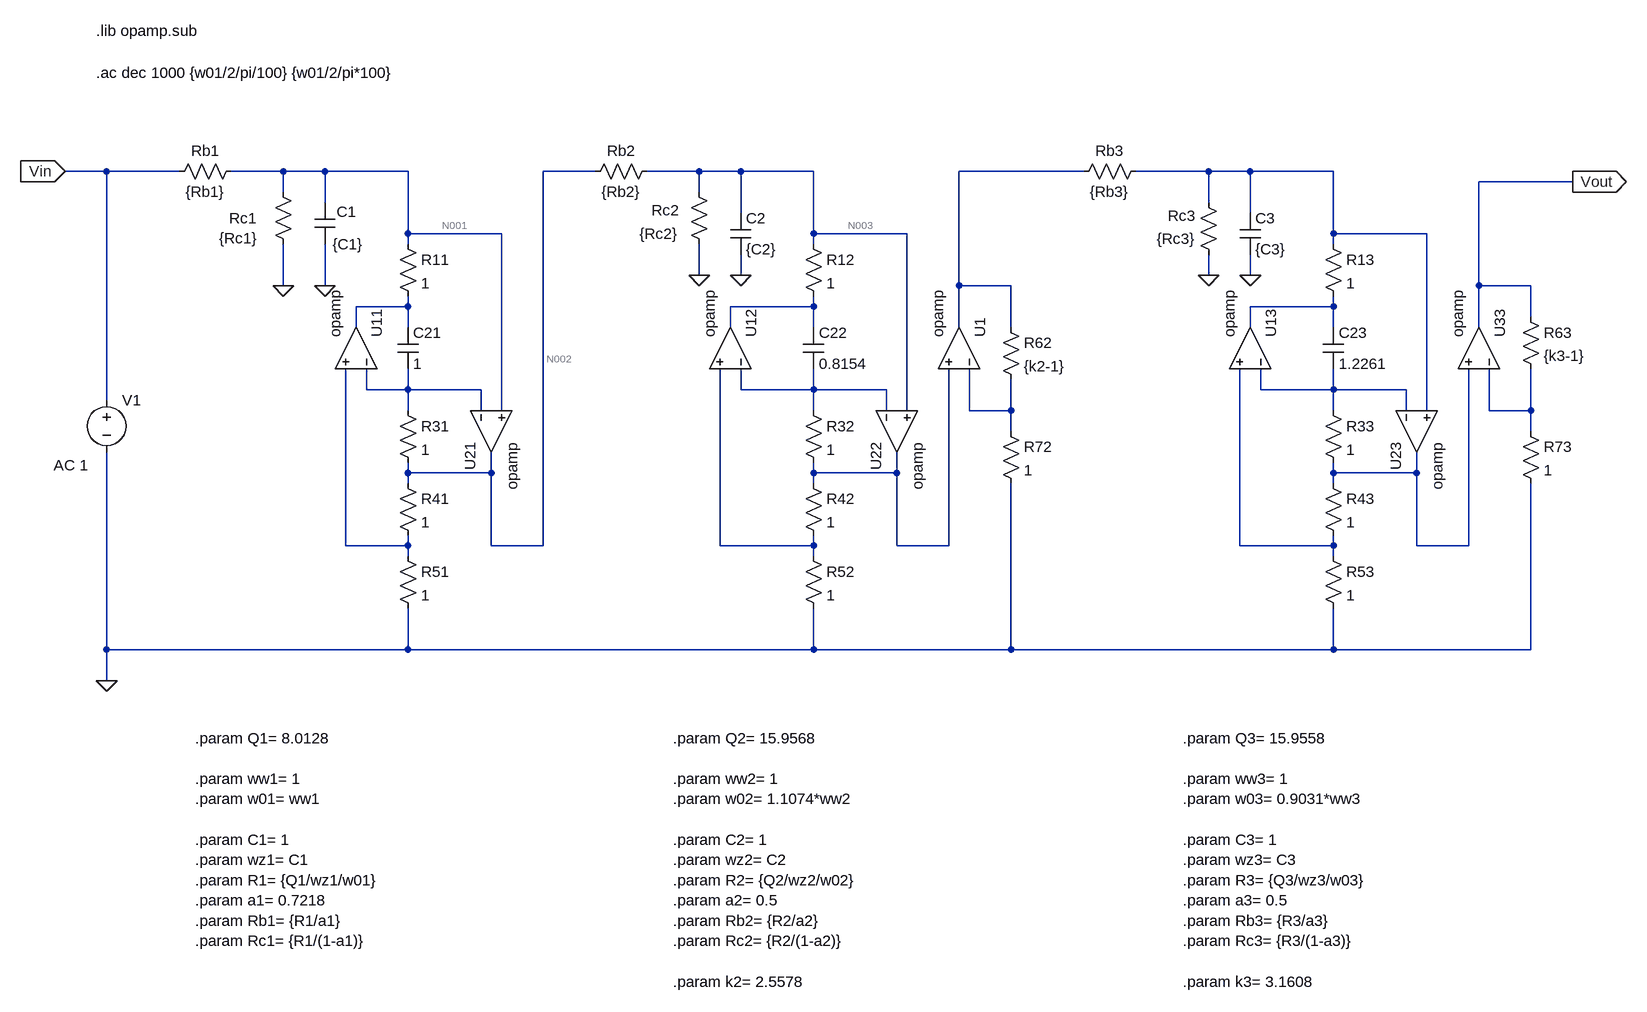
[diagram p0: schematic TS5_LTSpice_Red_Pasiva_SOSs_Acopladas_Activada.asc]
TS5_LTSpice_Red_Pasiva_SOSs_Acopladas_Activada.asc, the LTspice schematic file:
Version 4
SHEET 1 1864 1508
WIRE -544 -48 -608 -48
WIRE -432 -48 -544 -48
WIRE -272 -48 -352 -48
WIRE -208 -48 -272 -48
WIRE -80 -48 -208 -48
WIRE 208 -48 128 -48
WIRE 368 -48 288 -48
WIRE 432 -48 368 -48
WIRE 544 -48 432 -48
WIRE 960 -48 768 -48
WIRE 1152 -48 1040 -48
WIRE 1216 -48 1152 -48
WIRE 1344 -48 1216 -48
WIRE 1712 -32 1568 -32
WIRE -272 -16 -272 -48
WIRE 368 -16 368 -48
WIRE -208 0 -208 -48
WIRE 1152 0 1152 -48
WIRE 432 16 432 -48
WIRE 1216 16 1216 -48
WIRE -80 48 -80 -48
WIRE 64 48 -80 48
WIRE 544 48 544 -48
WIRE 688 48 544 48
WIRE 1344 48 1344 -48
WIRE 1488 48 1344 48
WIRE -80 64 -80 48
WIRE 544 64 544 48
WIRE 1344 64 1344 48
WIRE 368 112 368 64
WIRE 432 112 432 80
WIRE 1152 112 1152 80
WIRE 1216 112 1216 80
WIRE -272 128 -272 64
WIRE -208 128 -208 64
WIRE 768 128 768 -48
WIRE 848 128 768 128
WIRE 1568 128 1568 -32
WIRE 1648 128 1568 128
WIRE -80 160 -80 144
WIRE -80 160 -160 160
WIRE 544 160 544 144
WIRE 544 160 416 160
WIRE 1344 160 1344 144
WIRE 1344 160 1216 160
WIRE 1648 176 1648 128
WIRE -160 192 -160 160
WIRE -80 192 -80 160
WIRE 416 192 416 160
WIRE 544 192 544 160
WIRE 768 192 768 128
WIRE 848 192 848 128
WIRE 1216 192 1216 160
WIRE 1344 192 1344 160
WIRE 1568 192 1568 128
WIRE -144 288 -144 256
WIRE -80 288 -80 256
WIRE -80 288 -144 288
WIRE 32 288 -80 288
WIRE 432 288 432 256
WIRE 544 288 544 256
WIRE 544 288 432 288
WIRE 656 288 544 288
WIRE 1232 288 1232 256
WIRE 1344 288 1344 256
WIRE 1344 288 1232 288
WIRE 1456 288 1344 288
WIRE -544 304 -544 -48
WIRE -80 320 -80 288
WIRE 32 320 32 288
WIRE 64 320 64 48
WIRE 544 320 544 288
WIRE 656 320 656 288
WIRE 688 320 688 48
WIRE 784 320 784 256
WIRE 848 320 848 272
WIRE 848 320 784 320
WIRE 1344 320 1344 288
WIRE 1456 320 1456 288
WIRE 1488 320 1488 48
WIRE 1584 320 1584 256
WIRE 1648 320 1648 256
WIRE 1648 320 1584 320
WIRE 848 352 848 320
WIRE 1648 352 1648 320
WIRE -80 416 -80 400
WIRE 48 416 48 384
WIRE 48 416 -80 416
WIRE 544 416 544 400
WIRE 672 416 672 384
WIRE 672 416 544 416
WIRE 1344 416 1344 400
WIRE 1472 416 1472 384
WIRE 1472 416 1344 416
WIRE -80 432 -80 416
WIRE 544 432 544 416
WIRE 1344 432 1344 416
WIRE -176 528 -176 256
WIRE -80 528 -80 512
WIRE -80 528 -176 528
WIRE 48 528 48 416
WIRE 128 528 128 -48
WIRE 128 528 48 528
WIRE 400 528 400 256
WIRE 544 528 544 512
WIRE 544 528 400 528
WIRE 672 528 672 416
WIRE 752 528 752 256
WIRE 752 528 672 528
WIRE 1200 528 1200 256
WIRE 1344 528 1344 512
WIRE 1344 528 1200 528
WIRE 1472 528 1472 416
WIRE 1552 528 1552 256
WIRE 1552 528 1472 528
WIRE -80 544 -80 528
WIRE 544 544 544 528
WIRE 1344 544 1344 528
WIRE -544 688 -544 384
WIRE -80 688 -80 624
WIRE -80 688 -544 688
WIRE 544 688 544 624
WIRE 544 688 -80 688
WIRE 848 688 848 432
WIRE 848 688 544 688
WIRE 1344 688 1344 624
WIRE 1344 688 848 688
WIRE 1648 688 1648 432
WIRE 1648 688 1344 688
WIRE -544 736 -544 688
FLAG -544 736 0
FLAG -272 128 0
FLAG 368 112 0
FLAG -208 128 0
FLAG 432 112 0
FLAG 1216 112 0
FLAG 1152 112 0
FLAG 1712 -32 Vout
IOPIN 1712 -32 Out
FLAG -608 -48 Vin
IOPIN -608 -48 In
SYMBOL voltage -544 288 R0
WINDOW 123 -81 116 Left 2
WINDOW 39 0 0 Left 0
SYMATTR Value2 AC 1
SYMATTR InstName V1
SYMATTR Value ""
SYMBOL res -96 48 R0
SYMATTR InstName R11
SYMATTR Value 1
SYMBOL cap -96 192 R0
SYMATTR InstName C21
SYMATTR Value 1
SYMBOL res -96 304 R0
SYMATTR InstName R31
SYMATTR Value 1
SYMBOL res -96 416 R0
SYMATTR InstName R41
SYMATTR Value 1
SYMBOL res -96 528 R0
SYMATTR InstName R51
SYMATTR Value 1
SYMBOL OpAmps\\opamp -96 224 M270
SYMATTR InstName U11
SYMBOL OpAmps\\opamp -16 352 M90
SYMATTR InstName U21
SYMBOL res 352 -32 R0
WINDOW 0 -57 44 Left 2
WINDOW 3 -76 80 Left 2
SYMATTR InstName Rc2
SYMATTR Value {Rc2}
SYMBOL res 528 48 R0
SYMATTR InstName R12
SYMATTR Value 1
SYMBOL cap 528 192 R0
SYMATTR InstName C22
SYMATTR Value 0.8154
SYMBOL res 528 304 R0
SYMATTR InstName R32
SYMATTR Value 1
SYMBOL res 528 416 R0
SYMATTR InstName R42
SYMATTR Value 1
SYMBOL res 528 528 R0
SYMATTR InstName R52
SYMATTR Value 1
SYMBOL OpAmps\\opamp 480 224 M270
SYMATTR InstName U12
SYMBOL OpAmps\\opamp 608 352 M90
SYMATTR InstName U22
SYMBOL res 1328 48 R0
SYMATTR InstName R13
SYMATTR Value 1
SYMBOL cap 1328 192 R0
SYMATTR InstName C23
SYMATTR Value 1.2261
SYMBOL res 1328 304 R0
SYMATTR InstName R33
SYMATTR Value 1
SYMBOL res 1328 416 R0
SYMATTR InstName R43
SYMATTR Value 1
SYMBOL res 1328 528 R0
SYMATTR InstName R53
SYMATTR Value 1
SYMBOL OpAmps\\opamp 1280 224 M270
SYMATTR InstName U13
SYMBOL OpAmps\\opamp 1408 352 M90
SYMATTR InstName U23
SYMBOL res -336 -64 R90
WINDOW 0 0 56 VBottom 2
WINDOW 3 32 56 VTop 2
SYMATTR InstName Rb1
SYMATTR Value {Rb1}
SYMBOL res -288 -32 R0
WINDOW 0 -67 56 Left 2
WINDOW 3 -83 87 Left 2
SYMATTR InstName Rc1
SYMATTR Value {Rc1}
SYMBOL res 304 -64 R90
WINDOW 0 0 56 VBottom 2
WINDOW 3 32 56 VTop 2
SYMATTR InstName Rb2
SYMATTR Value {Rb2}
SYMBOL res 1056 -64 R90
WINDOW 0 0 56 VBottom 2
WINDOW 3 32 56 VTop 2
SYMATTR InstName Rb3
SYMATTR Value {Rb3}
SYMBOL res 1168 96 R180
WINDOW 0 36 76 Left 2
WINDOW 3 36 40 Left 2
SYMATTR InstName Rc3
SYMATTR Value {Rc3}
SYMBOL cap -224 0 R0
WINDOW 0 34 14 Left 2
WINDOW 3 28 64 Left 2
SYMATTR InstName C1
SYMATTR Value {C1}
SYMBOL cap 416 16 R0
SYMATTR InstName C2
SYMATTR Value {C2}
SYMBOL cap 1200 16 R0
SYMATTR InstName C3
SYMATTR Value {C3}
SYMBOL Opamps\\opamp 832 224 M270
SYMATTR InstName U1
SYMBOL Opamps\\opamp 1632 224 M270
SYMATTR InstName U33
SYMBOL res 832 176 R0
SYMATTR InstName R62
SYMATTR Value {k2-1}
SYMBOL res 832 336 R0
SYMATTR InstName R72
SYMATTR Value 1
SYMBOL res 1632 336 R0
SYMATTR InstName R73
SYMATTR Value 1
SYMBOL res 1632 160 R0
SYMATTR InstName R63
SYMATTR Value {k3-1}
TEXT -560 -200 Left 2 !.ac dec 1000 {w01/2/pi/100} {w01/2/pi*100}
TEXT -560 -264 Left 2 !.lib opamp.sub
TEXT -408 824 Left 2 !.param Q1= 8.0128\n \n.param ww1= 1\n.param w01= ww1\n \n.param C1= 1 \n.param wz1= C1\n.param R1= {Q1/wz1/w01}\n.param a1= 0.7218\n.param Rb1= {R1/a1}\n.param Rc1= {R1/(1-a1)}
TEXT 328 824 Left 2 !.param Q2= 15.9568\n \n.param ww2= 1\n.param w02= 1.1074*ww2\n \n.param C2= 1 \n.param wz2= C2\n.param R2= {Q2/wz2/w02}\n.param a2= 0.5\n.param Rb2= {R2/a2}\n.param Rc2= {R2/(1-a2)}\n \n.param k2= 2.5578
TEXT 1112 824 Left 2 !.param Q3= 15.9558\n \n.param ww3= 1\n.param w03= 0.9031*ww3\n \n.param C3= 1 \n.param wz3= C3\n.param R3= {Q3/wz3/w03}\n.param a3= 0.5\n.param Rb3= {R3/a3}\n.param Rc3= {R3/(1-a3)}\n \n.param k3= 3.1608

The netlist it stands for:
* TS5_LTSpice_Red_Pasiva_SOSs_Acopladas_Activada.asc
V1 Vin 0 AC 1
R11 N001 N006 1
C21 N006 N009 1
R31 N009 N002 1
R41 N002 N016 1
R51 N016 0 1
XU11 N009 N016 N006 opamp Aol=100K GBW=10Meg  ; pins invin noninvin out
XU21 N009 N001 N002 opamp Aol=100K GBW=10Meg  ; pins invin noninvin out
Rc2 N003 0 {Rc2}
R12 N003 N007 1
C22 N007 N010 0.8154
R32 N010 N014 1
R42 N014 N017 1
R52 N017 0 1
XU12 N010 N017 N007 opamp Aol=100K GBW=10Meg  ; pins invin noninvin out
XU22 N010 N003 N014 opamp Aol=100K GBW=10Meg  ; pins invin noninvin out
R13 N005 N008 1
C23 N008 N011 1.2261
R33 N011 N015 1
R43 N015 N018 1
R53 N018 0 1
XU13 N011 N018 N008 opamp Aol=100K GBW=10Meg  ; pins invin noninvin out
XU23 N011 N005 N015 opamp Aol=100K GBW=10Meg  ; pins invin noninvin out
Rb1 N001 Vin {Rb1}
Rc1 N001 0 {Rc1}
Rb2 N003 N002 {Rb2}
Rb3 N005 N004 {Rb3}
Rc3 0 N005 {Rc3}
C1 N001 0 {C1}
C2 N003 0 {C2}
C3 N005 0 {C3}
XU1 N012 N014 N004 opamp Aol=100K GBW=10Meg  ; pins invin noninvin out
XU33 N013 N015 Vout opamp Aol=100K GBW=10Meg  ; pins invin noninvin out
R62 N004 N012 {k2-1}
R72 N012 0 1
R73 N013 0 1
R63 Vout N013 {k3-1}
.ac dec 1000 {w01/2/pi/100} {w01/2/pi*100}
.lib opamp.sub
.param Q1= 8.0128
.param ww1= 1
.param w01= ww1
.param C1= 1
.param wz1= C1
.param R1= {Q1/wz1/w01}
.param a1= 0.7218
.param Rb1= {R1/a1}
.param Rc1= {R1/(1-a1)}
.param Q2= 15.9568
.param ww2= 1
.param w02= 1.1074*ww2
.param C2= 1
.param wz2= C2
.param R2= {Q2/wz2/w02}
.param a2= 0.5
.param Rb2= {R2/a2}
.param Rc2= {R2/(1-a2)}
.param k2= 2.5578
.param Q3= 15.9558
.param ww3= 1
.param w03= 0.9031*ww3
.param C3= 1
.param wz3= C3
.param R3= {Q3/wz3/w03}
.param a3= 0.5
.param Rb3= {R3/a3}
.param Rc3= {R3/(1-a3)}
.param k3= 3.1608
.backanno
.end

* Results of the author's LTspice run, read from the files saved beside the schematic
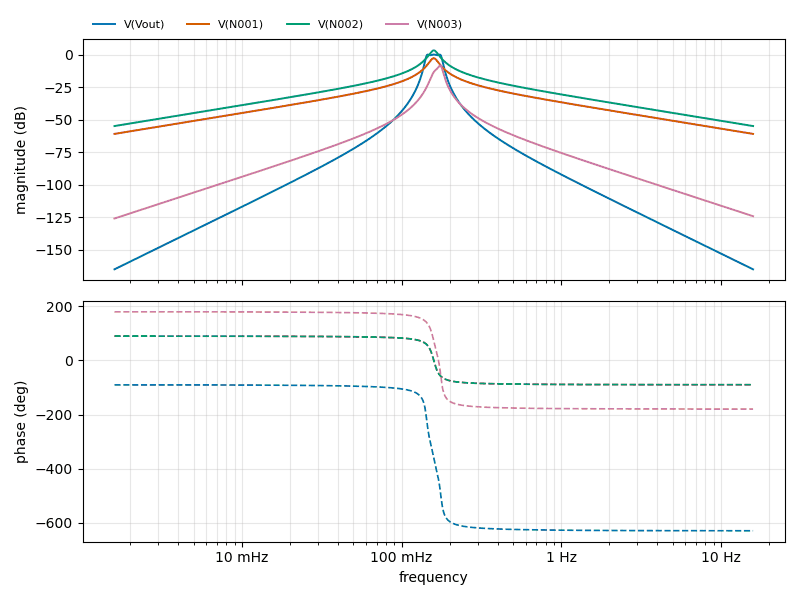
[diagram p1: AC Analysis of TS5_LTSpice_Red_Pasiva_SOSs_Acopladas_Activada.asc, plotted from the saved traces]
* AC Analysis, 1 run:
*   V(Vout): -164.85 dB at 1.592 mHz, -164.85 dB at 15.92 Hz, peak 0.02 dB at 159.2 mHz, 3 dB below the peak at 141.7 mHz and 178.7 mHz
*   V(N001): -60.91 dB at 1.592 mHz, -60.91 dB at 15.92 Hz, peak -2.84 dB at 159.2 mHz, 3 dB below the peak at 149.5 mHz and 169.4 mHz
*   V(N002): -54.89 dB at 1.592 mHz, -54.89 dB at 15.92 Hz, peak 3.18 dB at 159.2 mHz, 3 dB below the peak at 149.5 mHz and 169.4 mHz
*   V(N003): -125.85 dB at 1.592 mHz, -124.08 dB at 15.92 Hz, peak -8.27 dB at 174.9 mHz, 3 dB below the peak at 165.6 mHz and 179.9 mHz